# EAGLE schematic Utility_Micro_v81 (EAGLE 9.7.0)
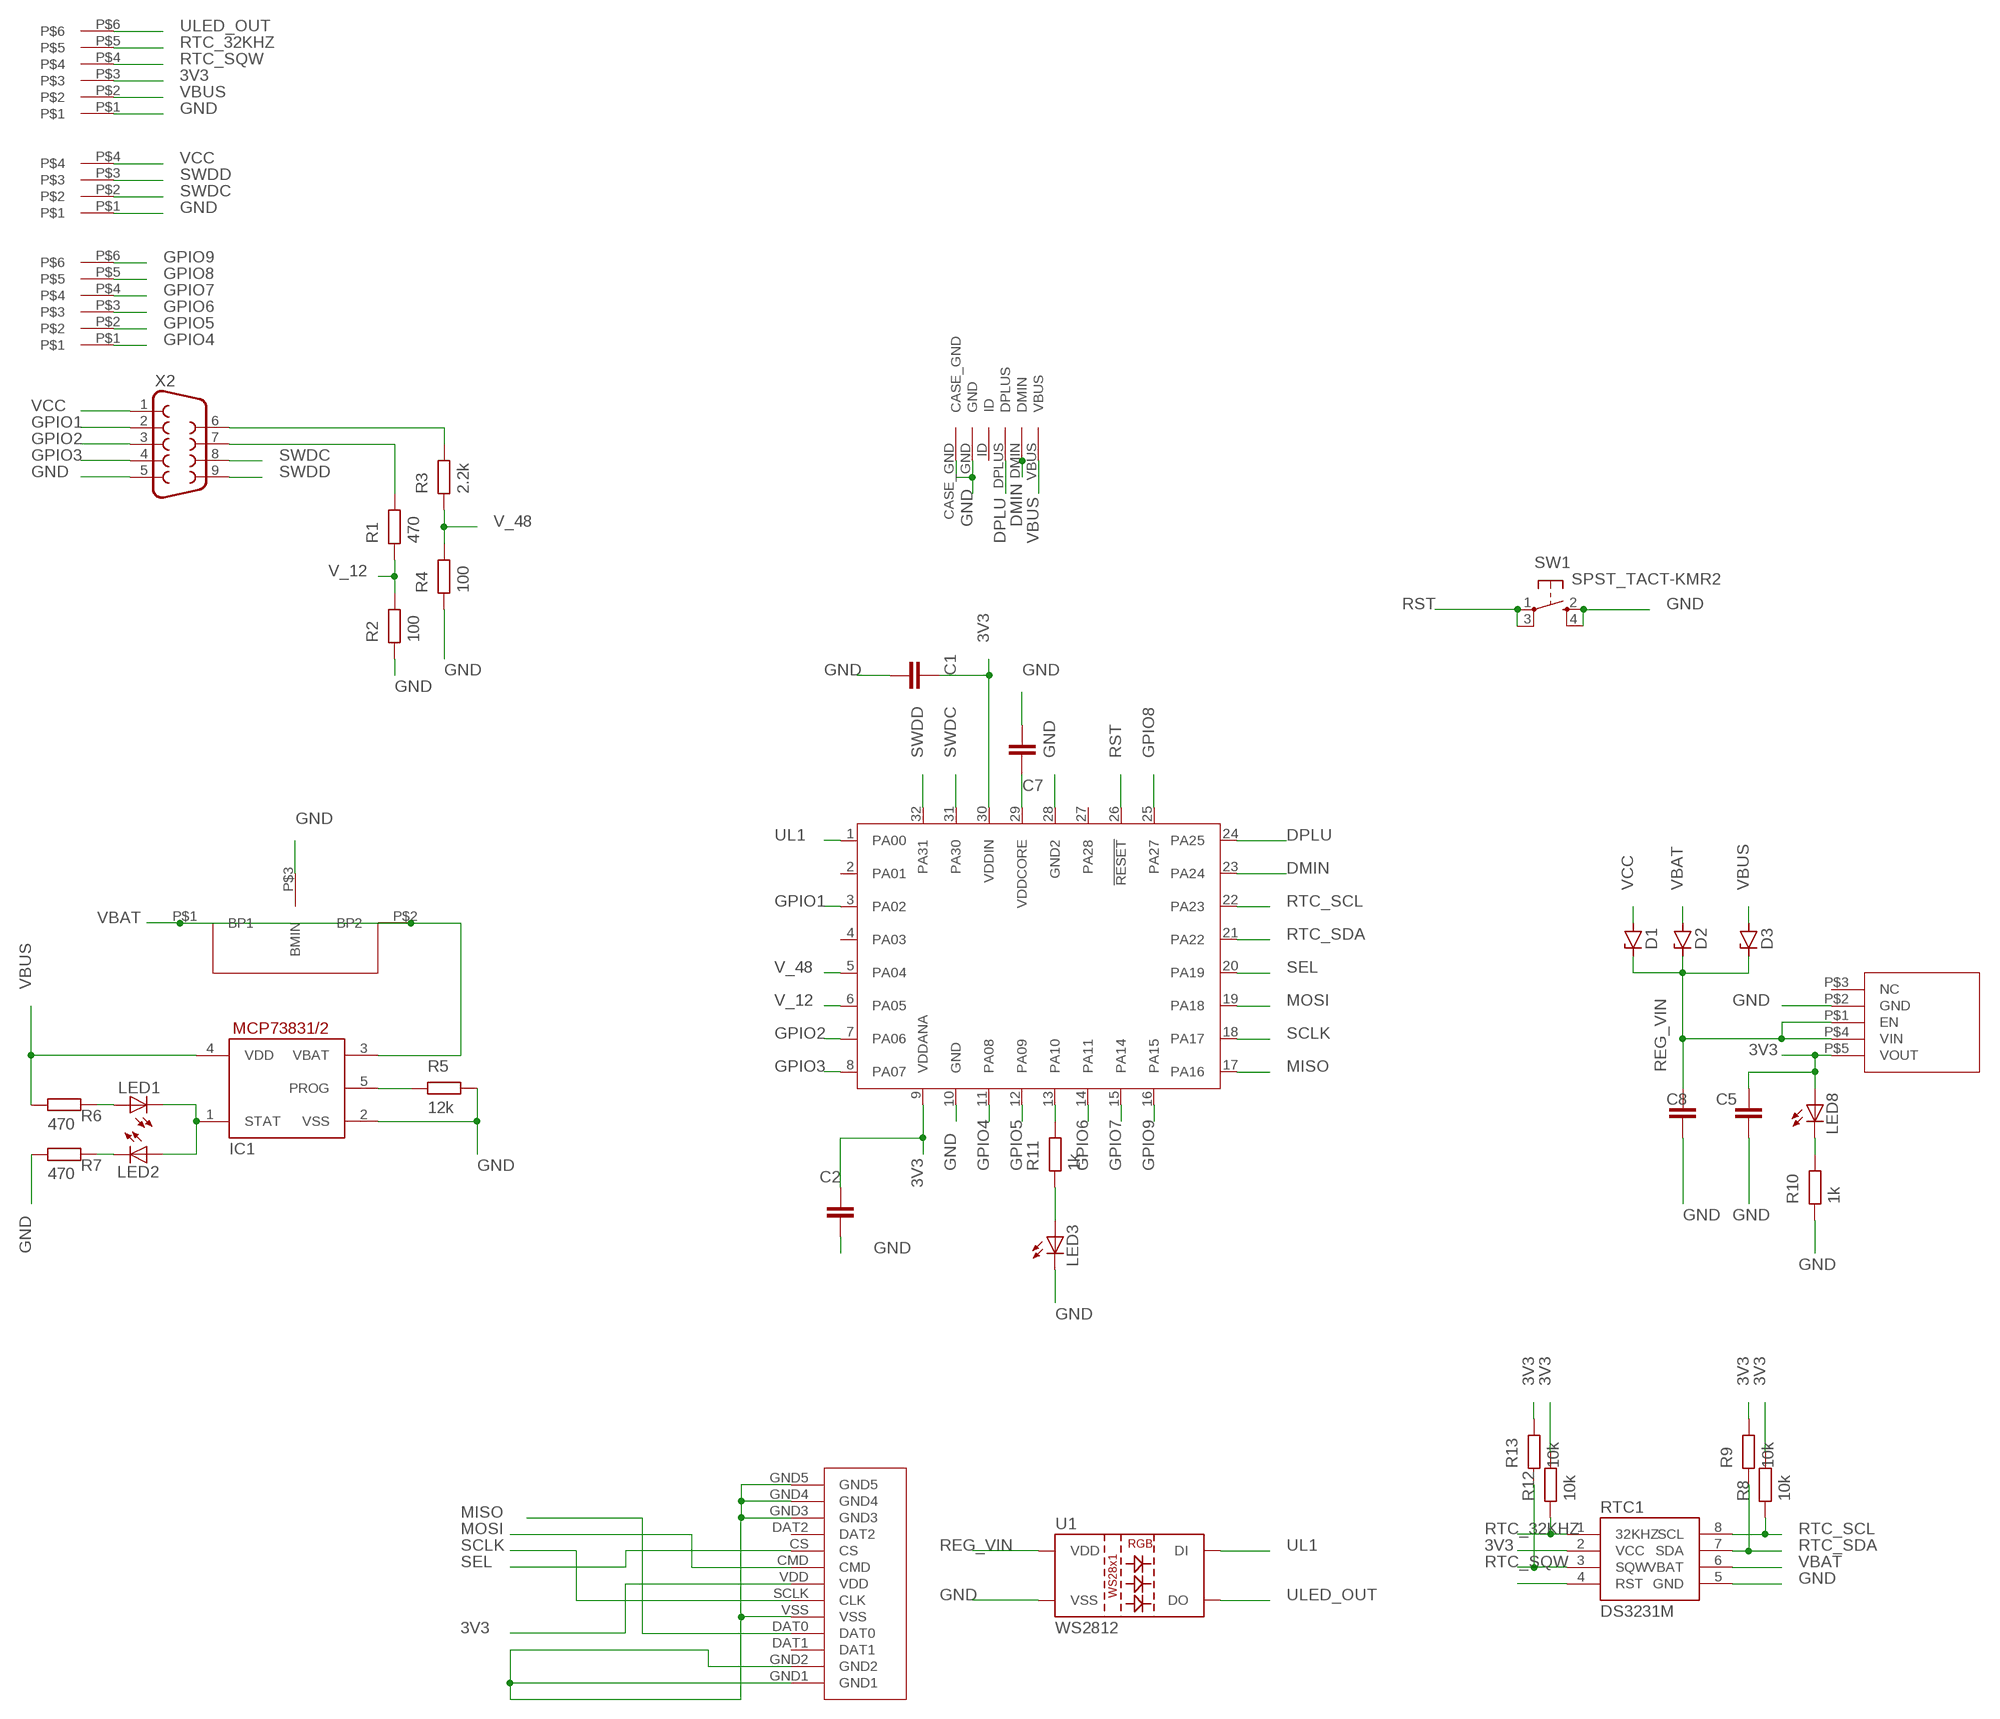
[diagram p0: schematic, sheet 1]

## Parts
ATSAMD21  ATSAMD21TQFP  [TQFP32-08]
C1  100nF  C_CHIP-0603(1608-METRIC)  [CAPC1608X85]
C2  100nF  C_CHIP-0603(1608-METRIC)  [CAPC1608X85]
C5  10uF  C_CHIP-0603(1608-METRIC)  [CAPC1608X85]
C7  1uF  C_CHIP-0603(1608-METRIC)  [CAPC1608X85]
C8  10uF  C_CHIP-0603(1608-METRIC)  [CAPC1608X85]
D1  SCHOTTKY_MBR0520LT1GDO-219-AB(SOD123F)  [SODFL3718X115]
D2  SCHOTTKY_MBR0520LT1GDO-219-AB(SOD123F)  [SODFL3718X115]
D3  SCHOTTKY_MBR0520LT1GDO-219-AB(SOD123F)  [SODFL3718X115]
IC1  MCP73831/OT  [SOT23-5L]
LED1  LEDCHIP-LED0603  [CHIP-LED0603]
LED2  LEDCHIP-LED0603  [CHIP-LED0603]
LED3  LEDCHIP-LED0603  [CHIP-LED0603]
LED8  LEDCHIP-LED0603  [CHIP-LED0603]
LIR_2450  LIR2450H  [BC-2005]
R1  470  R_CHIP-0603(1608-METRIC)  [RESC1608X60]
R2  100  R_CHIP-0603(1608-METRIC)  [RESC1608X60]
R3  2.2k  R_CHIP-0603(1608-METRIC)  [RESC1608X60]
R4  100  R_CHIP-0603(1608-METRIC)  [RESC1608X60]
R5  12k  R_CHIP-0603(1608-METRIC)  [RESC1608X60]
R6  470  R_CHIP-0603(1608-METRIC)  [RESC1608X60]
R7  470  R_CHIP-0603(1608-METRIC)  [RESC1608X60]
R8  10k  R_CHIP-0603(1608-METRIC)  [RESC1608X60]
R9  10k  R_CHIP-0603(1608-METRIC)  [RESC1608X60]
R10  1k  R_CHIP-0603(1608-METRIC)  [RESC1608X60]
R11  1k  R_CHIP-0603(1608-METRIC)  [RESC1608X60]
R12  10k  R_CHIP-0603(1608-METRIC)  [RESC1608X60]
R13  10k  R_CHIP-0603(1608-METRIC)  [RESC1608X60]
RTC1  DS3231M  [SO08]
SW1  SPST_TACT-KMR2  [KMR2]
U1  WS2812  WS2812"  [LED-TRICOLOR-5050-IC]
U$2  MOLEX_MICRO_USB  [MOLEX_MICRO_USB]
U$3  AP2112  [SOT-25]
U$4  TP_SMALL_6_DEVICE  [TP_SMALL_6]
U$5  TP_SMALL_6_DEVICE  [TP_SMALL_6]
U$6  SMALL_MICRO_SD  [MICRO_SD_SMALL]
U$10  TP_SMALL_4_DEVICE  [TP_SMALL_4]
X2  F09D  [F09D]

## Nets
3V3: ATSAMD21.9(VDDANA) ATSAMD21.30(VDDIN) C1.2 C2.2 C5.1 LED8.A R8.2 R9.2 R12.2 R13.2 RTC1.2(VCC) U$3.P$5(VOUT) U$4.P$3 U$6.VDD
48_V: R3.2 X2.6
DMIN: ATSAMD21.23(PA24) U$2.DMIN
DPLU: ATSAMD21.24(PA25) U$2.DPLUS
GND: ATSAMD21.10(GND) ATSAMD21.28(GND2) C1.1 C2.1 C5.2 C7.1 C8.2 IC1.2(VSS) LED3.C LIR_2450.P$3(BMIN) R2.1 R4.1 R5.2 R7.1 R10.1 RTC1.5(GND) SW1.2(S) SW1.4(S1) U1.6(VSS) U$2.CASE_GND U$2.GND U$3.P$2(GND) U$4.P$1 U$10.P$1 X2.5
GPIO1: ATSAMD21.3(PA02) X2.2
GPIO2: ATSAMD21.7(PA06) X2.3
GPIO3: ATSAMD21.8(PA07) X2.4
GPIO4: ATSAMD21.11(PA08) U$5.P$1
GPIO5: ATSAMD21.12(PA09) U$5.P$2
GPIO6: ATSAMD21.14(PA11) U$5.P$3
GPIO7: ATSAMD21.15(PA14) U$5.P$4
GPIO8: ATSAMD21.25(PA27) U$5.P$5
GPIO9: ATSAMD21.16(PA15) U$5.P$6
MISO: ATSAMD21.17(PA16) U$6.DAT0
MOSI: ATSAMD21.19(PA18) U$6.CMD
N$1: LED3.A R11.1
N$2: U$6.GND1 U$6.GND2 U$6.GND3 U$6.GND4 U$6.GND5 U$6.VSS
N$5: ATSAMD21.13(PA10) R11.2
N$6: ATSAMD21.29(VDDCORE) C7.2
N$11: R1.2 X2.7
N$13: IC1.5(PROG) R5.1
N$14: LED1.A R6.2
N$15: LED2.C R7.2
N$16: IC1.1(STAT) LED1.C LED2.A
N$17: LED8.C R10.2
N$27: RTC1.4(RST)
REG_VIN: C8.1 D1.2(C) D2.2(C) D3.2(C) U1.3(VDD) U1.5(VDD) U$3.P$1(EN) U$3.P$4(VIN)
RST: ATSAMD21.26(!RESET) SW1.1(P) SW1.3(P1)
RTC_32KHZ: R12.1 RTC1.1(32KHZ) U$4.P$5
RTC_SCL: ATSAMD21.22(PA23) R8.1 RTC1.8(SCL)
RTC_SDA: ATSAMD21.21(PA22) R9.1 RTC1.7(SDA)
RTC_SQW: R13.1 RTC1.3(SQW) U$4.P$4
SCLK: ATSAMD21.18(PA17) U$6.SCLK(CLK)
SEL: ATSAMD21.20(PA19) U$6.CS
SWDC: ATSAMD21.31(PA30) U$10.P$2 X2.8
SWDD: ATSAMD21.32(PA31) U$10.P$3 X2.9
UL1: ATSAMD21.1(PA00) U1.2(DI)
ULED_OUT: U1.1(DO) U$4.P$6
V_12: ATSAMD21.6(PA05) R1.1 R2.2
V_48: ATSAMD21.5(PA04) R3.1 R4.2
VBAT: D2.1(A) IC1.3(VBAT) LIR_2450.P$1(BP1) LIR_2450.P$2(BP2) RTC1.6(VBAT)
VBUS: D3.1(A) IC1.4(VDD) R6.1 U$2.VBUS U$4.P$2
VCC: D1.1(A) U$10.P$4 X2.1
Unconnected: ATSAMD21.2(PA01) ATSAMD21.4(PA03) ATSAMD21.27(PA28) U$2.ID U$3.P$3(NC) U$6.DAT1 U$6.DAT2

## Library data of the parts
ATSAMD21 = ATSAMD21:ATSAMD21: 8-bit AVR Microcontroller with 32K Bytes In-System Programmable Flash Datasheet <http://ww1.microchip.com/downloads/en/DeviceDoc/Atmel-7810-Automotive-Microcontrollers-ATmega328P_Datasheet.pdf>; CATEGORY: IC_Embedded; MANUFACTURER: Microchip; MPN: ATmega328P; OPERATING_TEMP: -40 to 85 °C; PART_STATUS: Active; SUB-CATEGORY: Microcontroller
C1 C2 C5 C7 C8 = Capacitor:C: Capacitor - Generic; CATEGORY: Capacitor
D1-D3 = Diode:SCHOTTKY_: Schottky Diode - Popular parts; CATEGORY: Diode; DESCRIPTION: DIODE SCHOTTKY 20V 500MA SOD123; MANUFACTURER: ON Semiconductor; MPN: MBR0520LT1G; SUB-CATEGORY: Schottky
IC1 = adafruit:MCP73831: MCP73831/2 Miniature Single-Cell, Fully Integrated Li-Ion, Li-Polymer Charge Management Controllers. Nice and small simple lipoly charge controller, with adjustable current and status output (LED) http://www.ladyada.net/library/pcb/eaglelibrary.html
LED1-LED3 LED8 = adafruit:LED: LED OSRAM: - CHIPLED LG R971, LG N971, LY N971, LG Q971, LY Q971, LO R971, LY R971 LH N974, LH R974 LS Q976, LO Q976, LY Q976 LO Q996 - Hyper CHIPLED LW Q18S LB Q993, LB Q99A, LB R99A - SideLED LS A670, LO A670, LY A670, LG A670, LP A670 LB A673, LV A673, LT A673, LW A673 LH A674 LY A675 LS A676, LA A676, LO A676, LY A676, LW A676 LS A679, LY A679, LG A679 - Hyper Micro SIDELED® LS Y876, LA Y876, LO Y876, LY Y876 LT Y87S - SmartLED LW L88C, LW L88S LB L89C, LB L89S, LG L890 LS L89K, LO L89K, LY L89K LS L896, LA L896, LO L896, LY L896 - TOPLED LS T670, LO T670, LY T670, LG T670, LP T670 LSG T670, LSP T670, LSY T670, LOP T670, LYG T670 LG T671, LOG T671, LSG T671 LB T673, LV T673, LT T673, LW T673 LH T674 LS T676, LA T676, LO T676, LY T676, LB T676, LH T676, LSB T676, LW T676 LB T67C, LV T67C, LT T67C, LS T67K, LO T67K, LY T67K, LW E67C LS E67B, LA E67B, LO E67B, LY E67B, LB E67C, LV E67C, LT E67C LW T67C LS T679, LY T679, LG T679 LS T770, LO T770, LY T770, LG T770, LP T770 LB T773, LV T773, LT T773, LW T773 LH T774 LS E675, LA E675, LY E675, LS T675 LS T776, LA T776, LO T776, LY T776, LB T776 LHGB T686 LT T68C, LB T68C - Hyper Mini TOPLED® LB M676 - Mini TOPLED Santana® LG M470 LS M47K, LO M47K, LY M47K Source: http://www.osram.convergy.de/
LIR_2450 = CoinCellHolders:LIR2450H
R1-R13 = Resistor:R: Resistor Fixed - Generic; CATEGORY: Resistor; SUB-CATEGORY: Fixed
RTC1 = SparkFun-Clocks:DS3231M: DS3231M Real Time Clock Accuracy +/-5ppm. Battery Backup. 2.3V to 5.5V. Datasheet <https://cdn.sparkfun.com/datasheets/Dev/Beagle/DS3231M.pdf> SparkFun Products CryptoCape <https://www.sparkfun.com/products/12773> (DEV-12773) SparkFun CryptoShield <https://www.sparkfun.com/products/13183> (DEV-13183); PROD_ID: IC-11985
SW1 = adafruit:SPST_TACT: SMT 6mm switch, EVQQ2 series http://www.ladyada.net/library/eagle
U1 = SparkFun-LED:WS2812: WS2812 RGB LED w/ WS2811 driver 5x5mm SMD LED with built-in controller IC. Color: Red/Green/Blue mC Rating: RGB: 550, 1100, 200 mcd Current:RGB: 20, 20, 20 mA Forward Voltage: RGB: 1.8, 3.0, 3.2 V Packages:LED-TRICOLOR-5050-IC SparkFun Products: LED-SMD RGB (WS2812) <https://www.sparkfun.com/products/11821>; PROD_ID: DIO-11598
U$2 = _microUSB.703a61e9-a720-4502-b905-a250d79a7013.flbr:MOLEX_MICRO_USB
U$3 = Voltage Regulator:AP2112
U$4 U$5 = Test_Points:TP_SMALL_6_DEVICE
U$6 = _Memory_Cards.85c9cb0b-4d3c-4a06-937b-9a27f087b036.flbr:SMALL_MICRO_SD
U$10 = Test_Points:TP_SMALL_4_DEVICE
X2 = con-subd:F09: SUB-D; OC_FARNELL: unknown; OC_NEWARK: unknown